# Altium schematic sheet 01_POWER.SchDoc
size A4
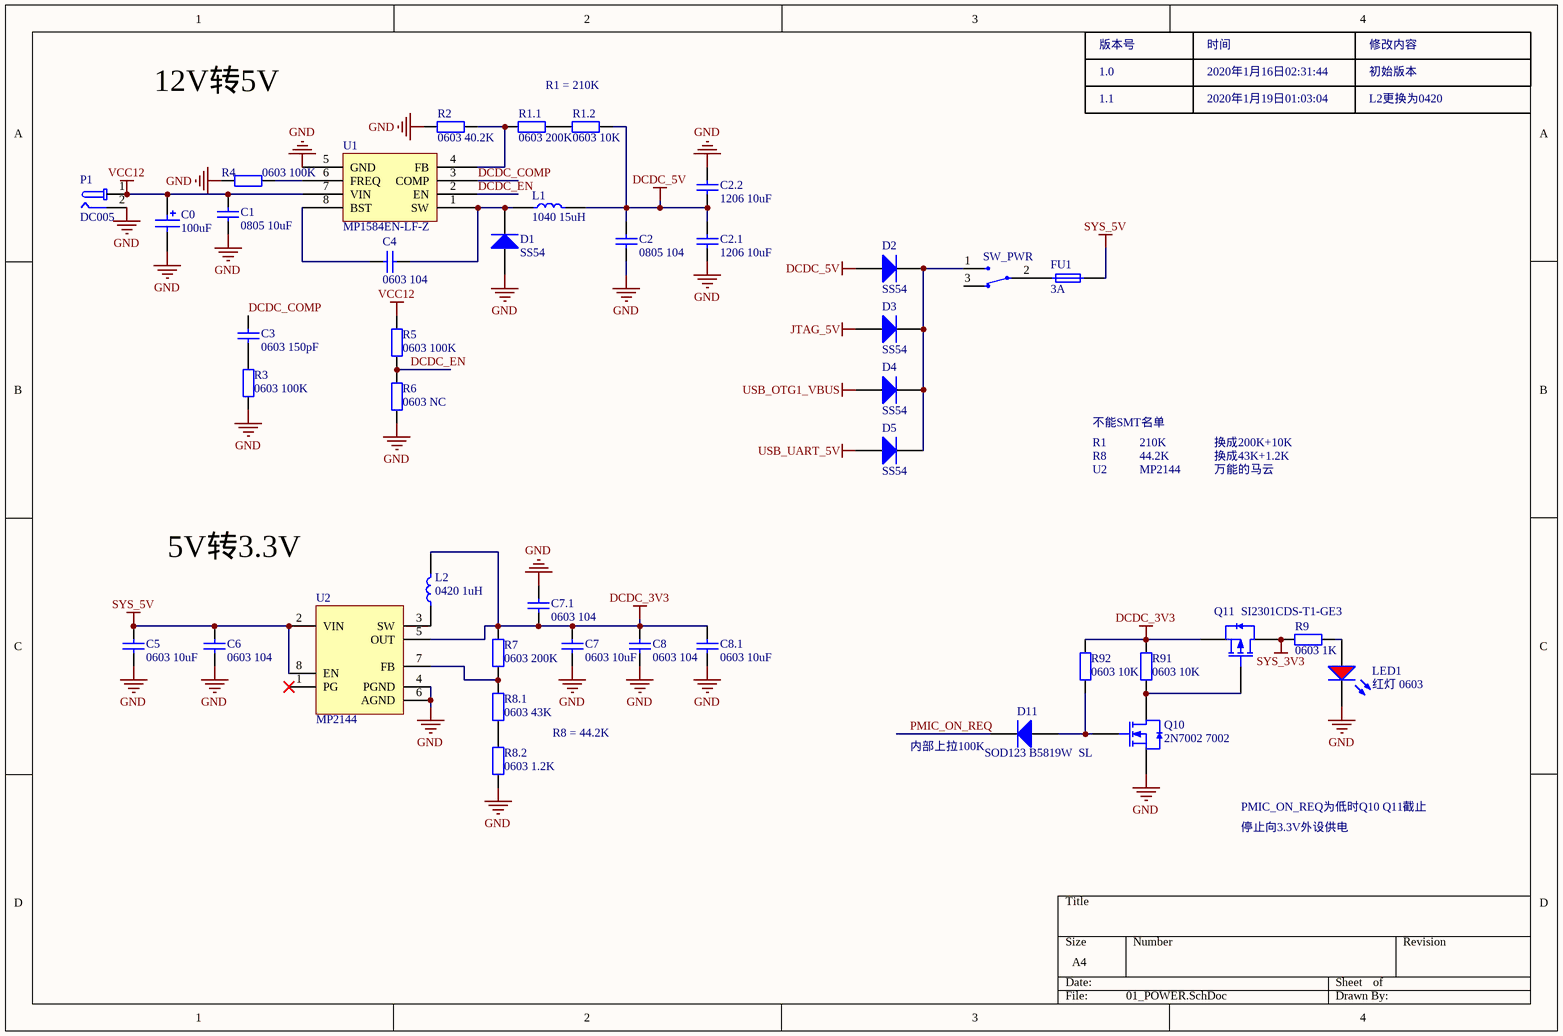
[diagram p0: 01_POWER.SchDoc]

## Parts
C0  100uF  [CAP1]
C1  0805 10uF  [LC-0805_C]
C2  0805 104  [LC-0805_C]
C2.1  1206 10uF  [LC-1206_C]
C2.2  1206 10uF  [LC-1206_C]
C3  0603 150pF  [LC-0603_C]
C4  0603 104  [LC-0603_C]
C5  0603 10uF  [LC-0603_C]
C6  0603 104  [LC-0603_C]
C7  0603 10uF  [LC-0603_C]
C7.1  0603 104  [LC-0603_C]
C8  0603 104  [LC-0603_C]
C8.1  0603 10uF  [LC-0603_C]
D1  SS54  [LC-SMA(DO-214AC)_S1]
D2  SS54  [LC-SMA(DO-214AC)_S1]
D3  SS54  [LC-SMA(DO-214AC)_S1]
D4  SS54  [LC-SMA(DO-214AC)_S1]
D5  SS54  [LC-SMA(DO-214AC)_S1]
D11  SOD123 B5819W  SL  [LC-SOD-123]
FU1  3A  [1812_FUSOR]
L1  1040 15uH  [L_1040]
L2  0420 1uH  [L_0420]
LED1  红灯 0603  [LC-0603_LED_S1]
P1  DC005  [DC005]
Q10  2N7002 7002  [LC-SOT-23(SOT-23-3)]
Q11  SI2301CDS-T1-GE3  [LC-SOT-23(SOT-23-3)]
R1.1  0603 200K  [LC-0603_R]
R1.2  0603 10K  [LC-0603_R]
R2  0603 40.2K  [LC-0603_R]
R3  0603 100K  [LC-0603_R]
R4  0603 100K  [LC-0603_R]
R5  0603 100K  [LC-0603_R]
R6  0603 NC  [LC-0603_R]
R7  0603 200K  [LC-0603_R]
R8.1  0603 43K  [LC-0603_R]
R8.2  0603 1.2K  [LC-0603_R]
R9  0603 1K  [LC-0603_R]
R91  0603 10K  [LC-0603_R]
R92  0603 10K  [LC-0603_R]
SW_PWR  (no value)  [SW_3P1]
U1  MP1584EN-LF-Z  [LC-SOIC-8_EP_150mil]
U2  MP2144  [SOT23-8L]

## Nets
DCDC_3V3: C7.2 C7.1.2 C8.2 C8.1.2 L2.1 Q11.2(S) R7.2 R91.2 R92.2 U2.5(OUT)
DCDC_5V: C2.2 C2.1.2 C2.2.2 D2.1(A) L1.1 R1.2.2
GND: C0.2 C1.1 C2.1 C2.1.1 C2.2.1 C5.1 C6.1 C7.1 C7.1.1 C8.1 C8.1.1 D1.1(A) LED1.K P1.2 Q10.2(S) R2.1 R3.1 R4.1 R6.1 R8.2.1 U1.5(GND) U2.4(PGND) U2.6(AGND)
JTAG_5V: D3.1(A)
SYS_3V3: Q11.3(D) R9.2
SYS_5V: C5.2 C6.2 FU1.2 U2.2(VIN) U2.8(EN)
USB_OTG1_VBUS: D4.1(A)
USB_UART_5V: D5.1(A)
VCC12: C0.1 C1.2 P1.1 R5.2 U1.7(VIN)
DCDC_COMP: C3.2 U1.3(COMP)
DCDC_EN: R5.1 R6.2 U1.2(EN)
PMIC_ON_REQ: D11.2(K)
NetC3_1: C3.1 R3.2
NetC4_1: C4.1 U1.8(BST)
NetC4_2: C4.2 D1.2(K) L1.2 U1.1(SW)
NetD2_2: D2.2(K) D3.2(K) D4.2(K) D5.2(K) SW_PWR.1
NetD11_1: D11.1(A) Q10.1(G) R92.1
NetFU1_1: FU1.1 SW_PWR.2
NetL2_2: L2.2 U2.3(SW)
NetLED1_A: LED1.A R9.1
NetQ10_3: Q10.3(D) Q11.1(G) R91.1
NetR1.1_1: R1.1.1 R2.2 U1.4(FB)
NetR1.1_2: R1.1.2 R1.2.1
NetR4_2: R4.2 U1.6(FREQ)
NetR7_1: R7.1 R8.1.2 U2.7(FB)
NetR8.1_1: R8.1.1 R8.2.2

Not connected (* = marked no-connect by the designer): SW_PWR 3; U2 1(PG)*

## Notes on the sheet
- 12V转5V
- R1 = 210K
- 版本号
- 1.0
- 1.1
- 2020年1月16日02:31:44
- 时间
- 2020年1月19日01:03:04
- 修改内容
- 初始版本
- L2更换为0420
- R1
- 不能SMT名单
- 210K
- 换成200K+10K
- R8
- U2
- 44.2K
- MP2144
- 换成43K+1.2K
- 万能的马云
- 5V转3.3V
- R8 = 44.2K
- 内部上拉100K
- PMIC_ON_REQ为低时Q10 Q11截止
- 停止向3.3V外设供电

## Library data of the parts
C0 = CAP1
C1 C2 = 0805 10uF (106) 10% 25V: 贴片电容; ComponentLink1Description: 供应商链接; ComponentLink1URL: http://www.szlcsc.com/product/details_16532.html; Package: 0805; Supplier: LC; SuppliersPartNumber: C15850
C2.1 C2.2 = 1206 10uF (106) 10% 50V: 贴片电容; ComponentLink1Description: 供应商链接; ComponentLink1URL: http://www.szlcsc.com/product/details_14236.html; Package: 1206; Supplier: LC; SuppliersPartNumber: C13585
C3-C7 C7.1 C8 C8.1 = 0603 1uF (105) 10% 50V: 贴片电容; ComponentLink1Description: 供应商链接; ComponentLink1URL: http://www.szlcsc.com/product/details_16531.html; Package: 0603; Supplier: LC; SuppliersPartNumber: C15849
D1-D5 = SMA(DO-214AC) SS54: 二极管; ComponentLink1Description: 供应商链接; ComponentLink1URL: http://www.szlcsc.com/product/details_23178.html; Package: SMA(DO-214AC); Supplier: LC; SuppliersPartNumber: C22452
D11 = SOD-123 B5819W  SL: 肖特基二极管; ComponentLink1Description: 供应商链接; ComponentLink1URL: http://www.szlcsc.com/product/details_9093.html; Package: SOD-123; Supplier: LC; SuppliersPartNumber: C8598
FU1 = FU
L1 L2 = Inductor
LED1 = 0603 红灯: 发光二极管; ComponentLink1Description: 供应商链接; ComponentLink1URL: http://www.szlcsc.com/product/details_2659.html; Package: 0603; Supplier: LC; SuppliersPartNumber: C2286
Q10 = 2N7002 7002: MOS(场效应管); ComponentLink1Description: 供应商链接; ComponentLink1URL: http://www.szlcsc.com/product/details_9040.html; Package: SOT-23(SOT-23-3); Supplier: LC; SuppliersPartNumber: C8545
Q11 = SI2301CDS-T1-GE3: MOS(场效应管); ComponentLink1Description: 供应商链接; ComponentLink1URL: http://www.szlcsc.com/product/details_11030.html; Package: SOT-23(SOT-23-3); Supplier: LC; SuppliersPartNumber: C10487
R1.1 R1.2 R2-R7 R8.1 R8.2 R9 = 0603 2.2KΩ (2201) 1%: 贴片电阻; ComponentLink1Description: 供应商链接; ComponentLink1URL: http://www.szlcsc.com/product/details_4597.html; Package: 0603; Supplier: LC; SuppliersPartNumber: C4190
R91 R92 = 0603 1.1KΩ (1101) 1%: 贴片电阻; ComponentLink1Description: 供应商链接; ComponentLink1URL: http://www.szlcsc.com/product/details_23491.html; Package: 0603; Supplier: LC; SuppliersPartNumber: C22764
SW_PWR = SW_3P
U1 = MP1584EN-LF-Z: DC-DC芯片; ComponentLink1Description: 供应商链接; ComponentLink1URL: http://www.szlcsc.com/product/details_15724.html; Package: SOIC-8_EP_150mil; Supplier: LC; SuppliersPartNumber: C15051